# EAGLE design cg1 (EAGLE 4.11)
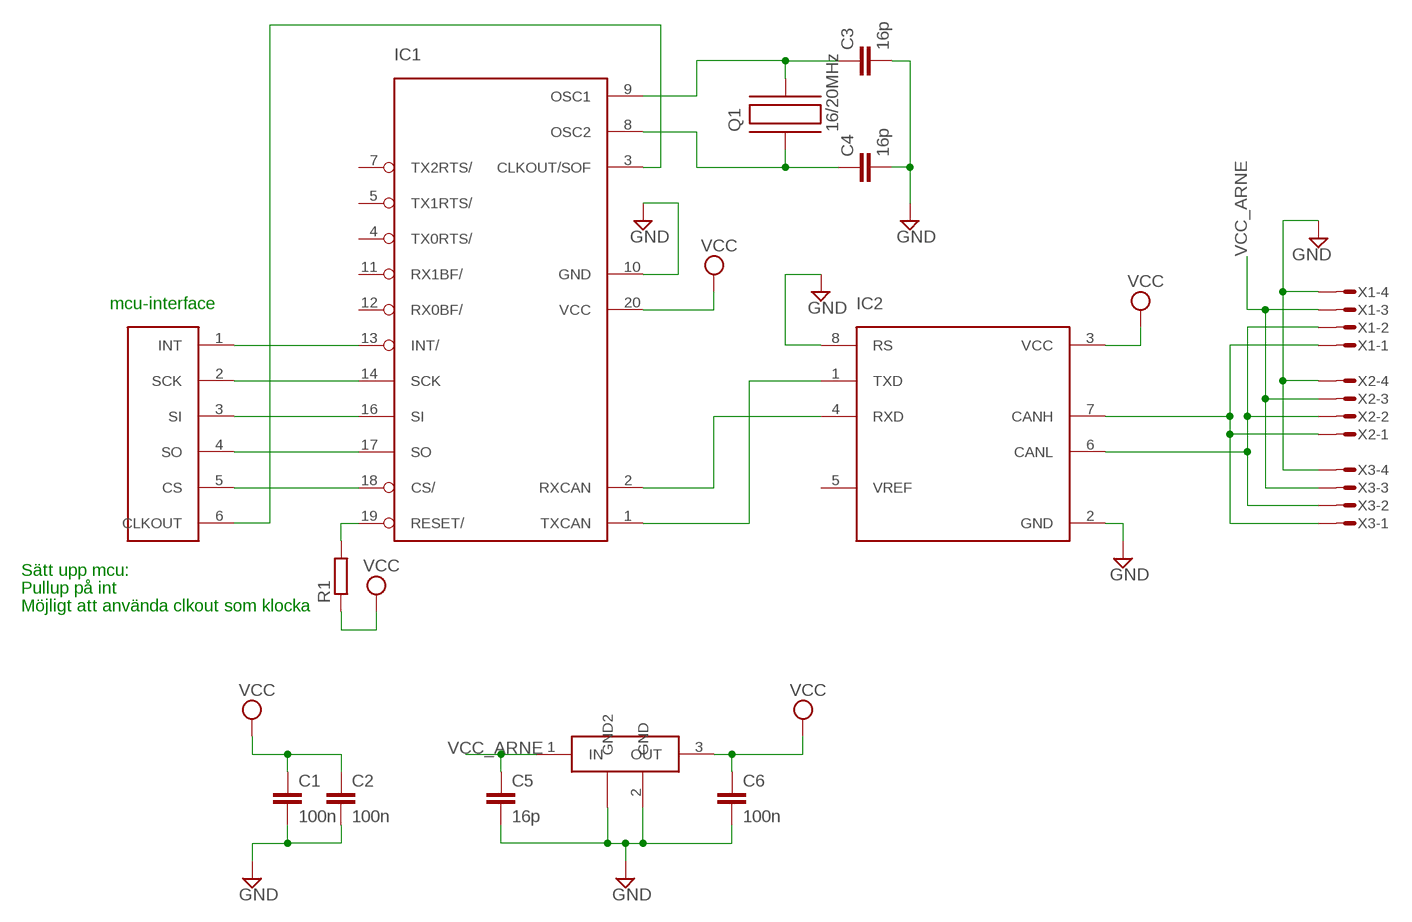
[diagram p0: schematic, sheet 1]

## Parts
C1  100n  C-EUC0603  [C0603]
C2  100n  C-EUC0603  [C0603]
C3  16p  C-EUC0603  [C0603]
C4  16p  C-EUC0603  [C0603]
C5  16p  C-EUC0603  [C0603]
C6  100n  C-EUC0603  [C0603]
IC1  MCP2515  [TSSOP]
IC2  MCP2551  [TSSOP]
Q1  16/20MHz  C-MAC-LFA147E  [SMD]
R1  R-EU_R0603  [R0603]
U$1  CAN-INTERFACE  [VIA-LIST]
U$2  LM340MP-5.0  [SOT223]
X1  MICROMATCH-4  [MICROMATCH-4-SMD]
X2  MICROMATCH-4  [MICROMATCH-4-SMD]
X3  MICROMATCH-4  [MICROMATCH-4-SMD]

## Nets
CANH: IC2.7(CANH) X1.1 X2.1 X3.1
CANL: IC2.6(CANL) X1.2 X2.2 X3.2
GND: C1.2 C2.2 C3.2 C4.2 C5.2 C6.2 IC1.10(GND) IC2.2(GND) IC2.8(RS) U$2.2(GND) U$2.4(GND2) X1.4 X2.4 X3.4
N$1: IC1.2(RXCAN) IC2.4(RXD)
N$2: IC1.1(TXCAN) IC2.1(TXD)
N$3: IC1.13(INT/) U$1.1(INT)
N$6: IC1.14(SCK) U$1.2(SCK)
N$7: IC1.16(SI) U$1.3(SI)
N$8: IC1.17(SO) U$1.4(SO)
N$9: IC1.3(CLKOUT/SOF) U$1.6(CLKOUT)
N$10: IC1.19(RESET/) R1.2
N$11: IC1.18(CS/) U$1.5(CS)
N$12: C3.1 IC1.9(OSC1) Q1.P$2
N$13: C4.1 IC1.8(OSC2) Q1.P$1
VCC: C1.1 C2.1 C6.1 IC1.20(VCC) IC2.3(VCC) R1.1 U$2.3(OUT)
VCC_ARNE: C5.1 U$2.1(IN) X1.3 X2.3 X3.3
Unconnected: IC1.4(TX0RTS/) IC1.5(TX1RTS/) IC1.7(TX2RTS/) IC1.11(RX1BF/) IC1.12(RX0BF/) IC2.5(VREF)

## Notes on the sheet
- mcu-interface
- Sätt upp mcu:
- Pullup på int
- Möjligt att använda clkout som klocka

## Library data of the parts
C1-C6 = rcl:C-EU: CAPACITOR, European symbol
IC1 = mcp2515:MCP2515
IC2 = mcp2551:MCP2551
Q1 = hc49-4h-smx:C-MAC-LFA147E
R1 = rcl:R-EU_: RESISTOR, European symbol
U$1 = can-interface:CAN-INTERFACE
U$2 = lm340mp:LM340MP-5.0
X1-X3 = micromatch-smd:MICROMATCH-4: MicroMaTch 4 7-215464-4 / 0-215464-4 Drawing Number C-215464 DDEController.pdf

## Board
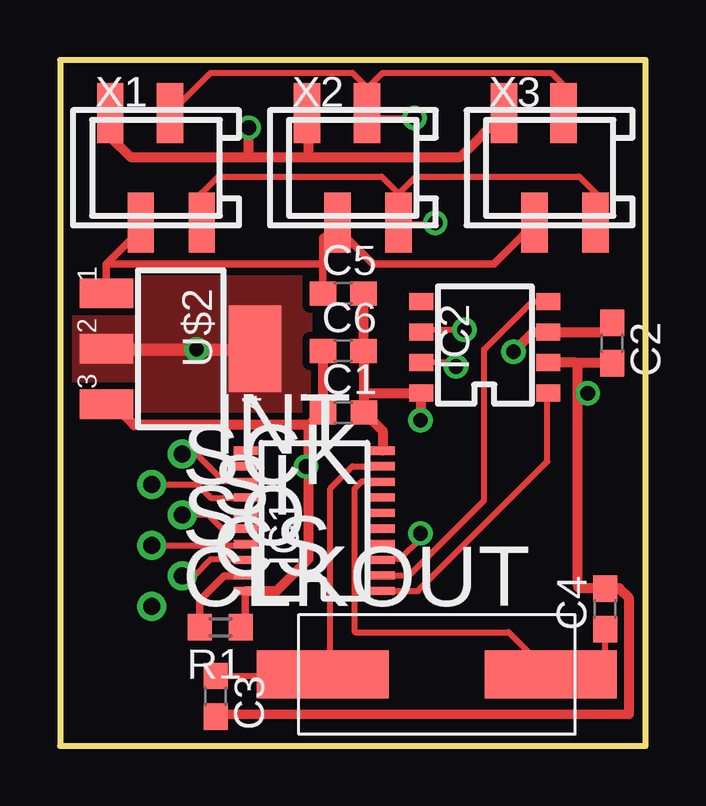
[diagram p1: board, top side]
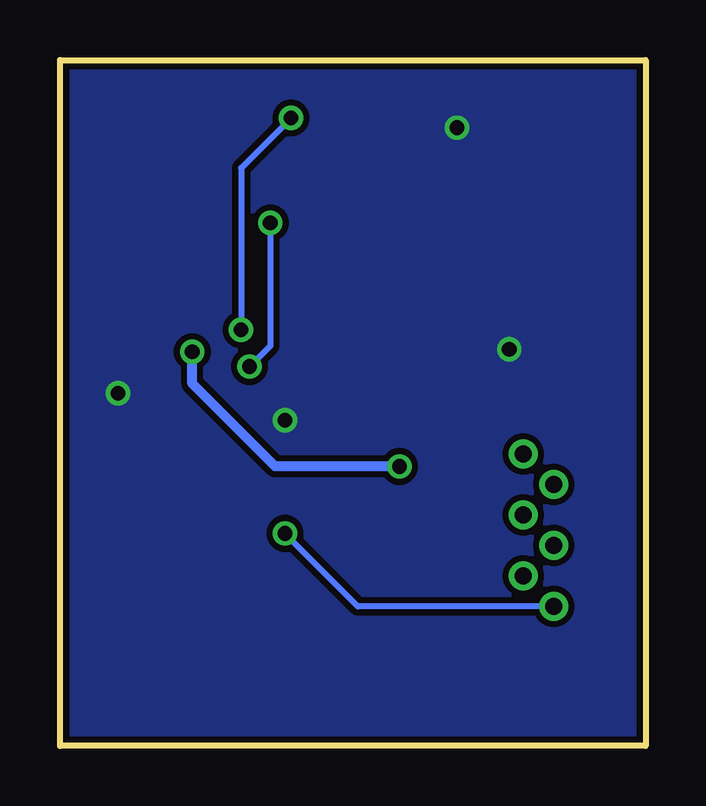
[diagram p2: board, bottom side, seen from below]

Size 24.4 x 28.6 mm. Coordinates in mm from the lower left corner, seen from the top.
Outline: 0,0 24.4,0 24.4,28.6 0,28.6 0,0
Copper layers (1*16): Top 0.035mm / dielectric 1.5mm / Bottom 0.035mm
Design rules "10mils, 0.6drill": minimum track width 10mil, minimum drill 0.6mm, track to track 10mil, track to pad 10mil, pad to pad 10mil, via to via 10mil, smd to smd 10mil, copper to edge 10mil, drill to drill 10mil, minimum pad ring 10mil, minimum via ring 8mil, stop-mask expansion 0mil, vias tented up to drill 0mil, thermal gap 10mil

### Footprints (pad centres in the part's own frame; a part is rotated, then mirrored left to right if it is on the bottom)
C0603 = smd 1.1 x 1: 1 -0.85,0; 2 0.85,0
TSSOP = smd 0.34 x 1: 1 -2.925,-2.85; 2 -2.275,-2.85; 3 -1.625,-2.85; 4 -0.975,-2.85; 5 -0.325,-2.85; 6 0.325,-2.85; 7 0.975,-2.85; 8 1.625,-2.85; 9 2.275,-2.85; 10 2.925,-2.85; 11 2.925,2.85; 12 2.275,2.85; 13 1.625,2.85; 14 0.975,2.85; 15 0.325,2.85; 16 -0.325,2.85; 17 -0.975,2.85; 18 -1.625,2.85; 19 -2.275,2.85; 20 -2.925,2.85
TSSOP' = smd 0.7 x 1: 1 -1.981,-2.645; 2 -0.711,-2.645; 3 0.559,-2.645; 4 1.829,-2.645; 5 1.829,2.645; 6 0.559,2.645; 7 -0.711,2.645; 8 -1.981,2.645
SMD = smd 5.5 x 2: P$1 4.75,0; P$2 -4.75,0
R0603 = smd 1 x 1.1: 1 -0.85,0; 2 0.85,0
VIA-LIST = drill 0.7 round: 1 0,2.54; 2 -1.27,1.27; 3 0,0; 4 -1.27,-1.27; 5 0,-2.54; 6 -1.27,-3.81
SOT223 = smd 1.219 x 2.235: 1 -2.311,-3.099; 2 0,-3.099; 3 2.311,-3.099 | smd 3.6 x 2.2: 4 0,3.099
MICROMATCH-4-SMD = smd 1.1 x 2.5: 1 1.905,-2.272; 2 0.585,2.272; 3 -0.635,-2.272; 4 -1.905,2.272

### Placement (x,y rotation side)
C1  11.81,13.89 0 top
C2  23,16.8 270 top
C3  6.48,2.07 270 top
C4  22.71,5.71 90 top
C5  11.8,18.86 0 top
C6  11.8,16.47 0 top
IC1  10.6,9.39 90 top
IC2  MCP2551  [TSSOP']  17.7,16.7 90 top
Q1  15.7,2.98 0 top
R1  6.68,4.95 180 top
U$1  5.09,9.63 0 top
U$2  5.03,16.55 270 top
X1  4,24.1 0 top
X2  12.2,24.1 0 top
X3  20.4,24.1 0 top

### Tracks (layer width: path | path; a pad name or v marks a point on that pad's centre or on a via)
CANH  (via drill 0.61)
  Top 0.254: X1.1 5.91,23.05 6.59,23.74 13.4,23.74 14.11,23.03 14.11,21.81 X2.1 | X2.1 14.11,23.02 14.82,23.74 21.63,23.74 22.34,23.03 22.34,21.91 22.25,21.83 | 22.25,21.83 22.24,21.81 | 22.25,21.83 X3.1 | IC2.7 16.33,15.99 v16.5,15.82 | X2.1 14.11,21.82 14.11,21.76 15.59,21.76 v15.64,21.81
  Bottom 0.254: v16.5,15.82 15.64,16.68 v15.64,21.81
CANL  (via drill 0.61)
  Top 0.254: X1.2 6.28,28.06 12.18,28.06 12.69,27.55 12.69,26.39 12.77,26.39 X2.2 | X2.2 12.79,27.39 13.45,28.06 20.46,28.06 20.92,27.6 20.92,26.49 21.02,26.39 21.01,26.37 X3.2 | IC2.6 15.14,17.34 v16.86,17.34 | X2.2 12.81,26.37 13,26.18 v14.77,26.18
  Bottom 0.254: v16.86,17.34 16.86,24.1 v14.77,26.18
GND  (via drill 0.61)
  Top 0.254: 6.26,1.29 6.39,1.34 | 21.91,6.57 C4.2 | C2.2 22.98,15.95 22.95,15.92 22.88,15.99 | 21.43,15.99 IC2.2 | C1.2 12.69,13.89 | 12.69,16.53 12.65,16.49 C6.2 12.69,16.43 | 21.43,15.99 21.43,16.02 | 21.43,15.99 21.58,15.97 21.41,15.99 | 12.69,14.7 12.69,14.72 | 7.86,24.56 10.31,24.66 X2.4 10.35,26.31 | 2.12,26.4 2.12,26.49 | 2.12,26.4 X1.4 | 2.12,25.37 2.12,26.4 | IC2.8 15.03,14.69
  Top 0.406: C3.2 6.26,1.29 | 6.39,1.34 23.71,1.32 23.71,6.17 23.31,6.57 21.91,6.57 21.63,6.57 21.58,6.78 21.58,15.11 | 21.43,15.99 22.88,15.99 | IC1.10 13.45,13.13 12.69,13.89 12.69,14.7 12.69,16.53 | C6.2 C5.2 | 21.58,15.11 21.58,15.97 | 12.69,14.72 IC2.8 | 7.86,24.56 2.94,24.56 2.12,25.37 | X3.4 16.68,24.56 10.35,24.56 | 10.35,24.56 10.35,26.31 | 15.03,14.69 v15.03,13.58 | 21.41,15.99 IC2.2 | 21.58,15.11 v21.99,14.7 | 7.86,24.56 10.35,24.56 | 7.86,24.56 v7.86,25.78
  Top 0.508: U$2.4 8.11,16.53 v5.68,16.53 1.96,16.53 U$2.2
  Bottom 0.254: v5.68,16.53 5.58,16.53 | v15.03,13.58 15.03,13.53 | v21.99,14.7 21.89,14.7 | v7.86,25.78 7.86,25.62
  pour Bottom: -0.01,28.62 24.38,28.62 24.38,0.07 24.38,-0.03 -0.01,-0.03
  pour Top (isolate 0.305, no thermals): 10.25,19.68 10.25,13.79 0.75,13.79 0.75,19.68
N$1
  Top 0.254: IC1.2 14.55,7.11 17.67,10.23 17.67,16.53 19.67,18.53 IC2.4
N$2
  Top 0.254: IC1.1 14.92,6.46 20.31,11.86 20.31,14.6 20.34,14.63 IC2.1
N$3
  Top 0.254: U$1.1 5.67,12.17 6.8,11.04 7.71,11.04 IC1.13
N$6
  Top 0.254: U$1.2 5.73,10.9 6.29,10.33 7.71,10.33 IC1.14
N$7
  Top 0.254: U$1.3 6.18,9.63 6.7,9.11 7.61,9.11 7.66,9.06 IC1.16
N$8
  Top 0.254: IC1.17 7.72,8.41 7.67,8.36 U$1.4
N$9  (via drill 0.61)
  Top 0.254: IC1.3 13.45,7.79 14.16,7.79 15.03,8.66 v15.03,8.86
  Bottom 0.254: U$1.6 11.99,5.82 v15.03,8.86
N$10
  Top 0.254: 7.71,7.08 IC1.19
  Top 0.305: R1.2 5.83,6.06 6.85,7.08 7.66,7.08 7.69,7.11 IC1.19
N$11
  Top 0.254: U$1.5 5.58,7.09 6.29,7.79 7.61,7.79 7.64,7.76 IC1.18
N$12
  Top 0.254: C3.1 6.44,2.92 9.47,2.92 Q1.P$2 11.27,3.96 11.27,10.74 12.18,11.65 IC1.9
N$13
  Top 0.254: C4.1 22.7,3.02 19.07,3.02 Q1.P$1 18.69,4.74 12.29,4.74 12.29,10.74 12.59,11.04 13.41,11.04 IC1.8
VCC  (via drill 0.61)
  Top 0.254: 22.95,17.65 C2.1 | 10.87,13.89 C1.1 | 1.92,14.29 2.19,14.29 U$2.3 | 10.92,16.47 10.86,16.53 | 10.92,16.47 C6.1 | 10.96,16.43 10.92,16.47 | 10.35,11.75 v10.25,11.65
  Top 0.305: IC1.20 7.71,6.43 7.71,5.48 R1.1
  Top 0.406: 22.95,17.65 22.56,17.26 IC2.3 19.72,17.26 v18.89,16.43 | IC1.20 9.02,6.46 10.35,7.79 10.35,11.75 10.35,13.38 | 10.35,13.38 10.87,13.89 | 10.35,13.38 3.09,13.38 2.19,14.29 | C1.1 10.96,16.43
  Bottom 0.406: v18.89,16.43 18.89,15.11 15.43,11.65 v10.25,11.65
VCC_ARNE
  Top 0.254: C5.1 10.97,18.86 10.96,18.87 10.96,20.08 | 3.05,21.22 X1.3 | 1.92,20.08 1.92,20.09 | 10.95,21.19 11.56,21.8 X2.3 11.56,21.57 | 19.77,21.77 X3.3
  Top 0.305: U$2.1 1.92,20.08 10.96,20.08 | 1.92,20.09 3.05,21.22 | C5.1 10.95,21.19 | 11.56,21.57 13.05,20.09 18.08,20.09 19.77,21.77